# Altium schematic sheet Current_Sense.SchDoc
size A4
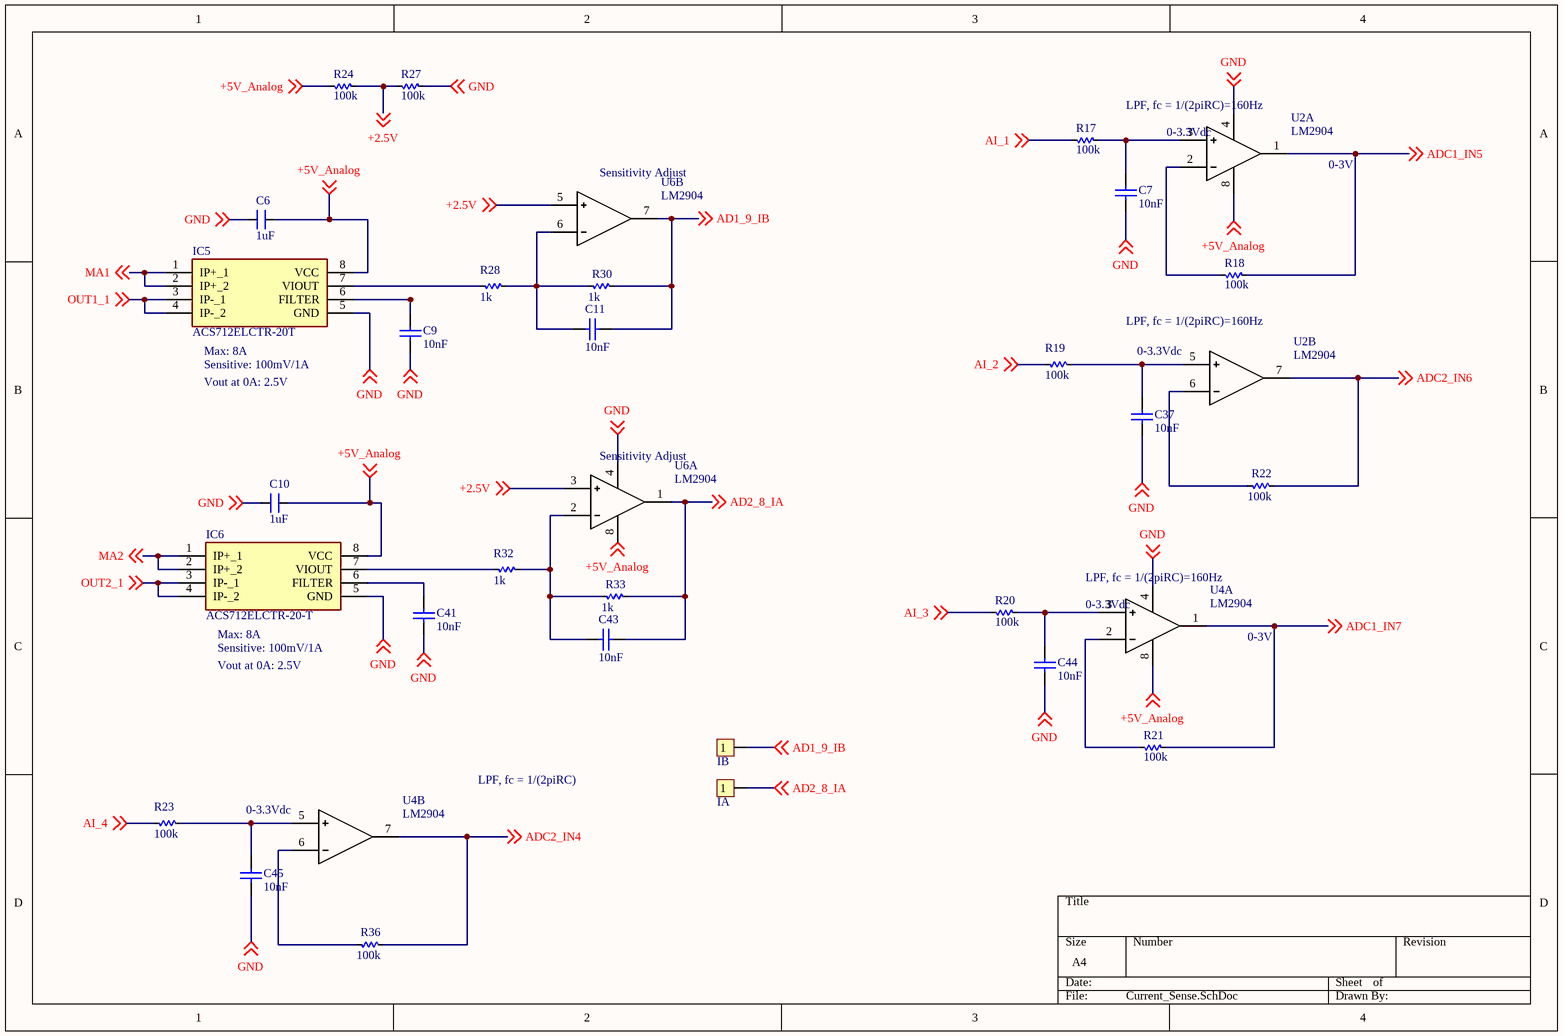
[diagram p0: Current_Sense.SchDoc]

## Parts
C6  1uF  [CM-0805 capacitor]
C7  10nF  [tu 0603]
C9  10nF  [tu 0603]
C10  1uF  [CM-0805 capacitor]
C11  10nF  [tu 0603]
C37  10nF  [tu 0603]
C41  10nF  [tu 0603]
C43  10nF  [tu 0603]
C44  10nF  [tu 0603]
C45  10nF  [tu 0603]
IA  IA  [JP 1x1 DT]
IB  IB  [JP 1x1 DT]
IC5  ACS712ELCTR-20T  [SO8]
IC6  ACS712ELCTR-20-T  [SO8]
R17  100k  [RES-SMD-0603]
R18  100k  [RES-SMD-0603]
R19  100k  [RES-SMD-0603]
R20  100k  [RES-SMD-0603]
R21  100k  [RES-SMD-0603]
R22  100k  [RES-SMD-0603]
R23  100k  [RES-SMD-0603]
R24  100k  [RES-SMD-0603]
R27  100k  [RES-SMD-0603]
R28  1k  [RES-SMD-0603]
R30  1k  [RES-SMD-0603]
R32  1k  [RES-SMD-0603]
R33  1k  [RES-SMD-0603]
R36  100k  [RES-SMD-0603]
U2  LM2904  [SO8]  (parts A,B of 2)
U4  LM2904  [SO8]  (parts A,B of 2)
U6  LM2904  [SO8]  (parts A,B of 2)

## Nets
+2.5V: R24.1 R27.2 U6.3 U6.5 ; off-sheet +2.5V
+5V_Analog: C6.1 C10.1 IC5.8(VCC) IC6.8(VCC) R24.2 U2.8(Vcc+) U4.8(Vcc+) U6.8(Vcc+) ; off-sheet +5V_Analog
AD1_9_IB: C11.2 IB.1 R30.1 U6.7 ; off-sheet AD1_9_IB
AD2_8_IA: C43.2 IA.1 R33.1 U6.1 ; off-sheet AD2_8_IA
ADC1_IN5: R18.2 U2.1 ; off-sheet ADC1_IN5
ADC1_IN7: R21.2 U4.1 ; off-sheet ADC1_IN7
ADC2_IN4: R36.1 U4.7 ; off-sheet ADC2_IN4
ADC2_IN6: R22.1 U2.7 ; off-sheet ADC2_IN6
AI_1: R17.2 ; off-sheet AI_1
AI_2: R19.1 ; off-sheet AI_2
AI_3: R20.2 ; off-sheet AI_3
AI_4: R23.1 ; off-sheet AI_4
GND: C6.2 C7.2 C9.2 C10.2 C37.2 C41.1 C44.1 C45.2 IC5.5(GND) IC6.5(GND) R27.1 U2.4(Vcc-) U4.4(Vcc-) U6.4(Vcc-) ; off-sheet GND
MA1: IC5.1(IP+_1) IC5.2(IP+_2) ; off-sheet MA1
MA2: IC6.1(IP+_1) IC6.2(IP+_2) ; off-sheet MA2
OUT1_1: IC5.3(IP-_1) IC5.4(IP-_2) ; off-sheet OUT1_1
OUT2_1: IC6.3(IP-_1) IC6.4(IP-_2) ; off-sheet OUT2_1
NetC7_1: C7.1 R17.1 U2.3
NetC9_1: C9.1 IC5.6(FILTER)
NetC11_1: C11.1 R28.2 R30.2 U6.6
NetC37_1: C37.1 R19.2 U2.5
NetC41_2: C41.2 IC6.6(FILTER)
NetC43_1: C43.1 R32.2 R33.2 U6.2
NetC44_2: C44.2 R20.1 U4.3
NetC45_1: C45.1 R23.2 U4.5
NetIC5_7: IC5.7(VIOUT) R28.1
NetIC6_7: IC6.7(VIOUT) R32.1
NetR18_1: R18.1 U2.2
NetR21_1: R21.1 U4.2
NetR22_2: R22.2 U2.6
NetR36_2: R36.2 U4.6

## Notes on the sheet
- (near R17) LPF, fc = 1/(2piRC)=160Hz
- (near U6) Sensitivity Adjust
- 0-3.3Vdc
- (near U2) 0-3V
- (near IC5) Max: 8A
- (near IC5) Sensitive: 100mV/1A
- (near R19) LPF, fc = 1/(2piRC)=160Hz
- (near R19) 0-3.3Vdc
- Vout at 0A: 2.5V
- (near R20) LPF, fc = 1/(2piRC)=160Hz
- (near IC6) Max: 8A
- (near IC6) Sensitive: 100mV/1A
- (near U4) 0-3V
- (near U4) LPF, fc = 1/(2piRC)
- (near R23) 0-3.3Vdc

## Library data of the parts
C6 C10 = CN: 0805_SMD_20pF; Value: 100pF
C7 C9 C11 C37 C41 C43-C45 = Tu 0603 102 50V 10%: Dán; Don_Vi: Con; So_Chan: 2; Ten_Linh_Kien: Tụ 0603 102-1nF 10% 50V; Ma_Hang: MH004566; Chung_Loai: Dán; Kieu_Chan: *
IA IB = JP 1x1 2.54 Duc Cong: Cắm; Ten_Linh_Kien: Jump Đơn Đực 2.54MM 1x40P Cong Đứng; Don_Vi: Con; Ma_Hang: MH000904; Ghi_Chu: *; Kieu_Chan: *; Chung_Loai: Cắm
IC5 IC6 = ACS712ELCTR-20A-T: Integrated Circuit; Manufacturer_Name: Allegro Microsystems; Datasheet Link: http://docs-emea.rs-online.com/webdocs/0d88/0900766b80d885f5.pdf; Height: 1.75mm; Manufacturer_Part_Number: ACS712ELCTR-20A-T; Arrow Part Number: ACS712ELCTR-20A-T; Arrow Price/Stock: https://www.arrow.com/en/products/acs712elctr-20a-t/allegro-microsystems
R17-R24 R27 R28 R30 R32 R33 R36 = Res-SMD: Resistor; Manufacturer: Generic Components; Class: Passive; Published: 08/06/2000; Publisher: Altium Hobart Technology Centre
U2 U4 U6 = LM393-SPLIT: IC DUAL COMPARATOR; Supplier 1: Digi-Key; Supplier Part Number 1: LM393MXFSDKR-ND